# Altium schematic sheet Zynq Programmable Logic System (PL).SchDoc: Zynq Programmable Logic
size A3; DocumentNumber: 6; Revision: A; SheetNumber: 6; SheetTotal: 10
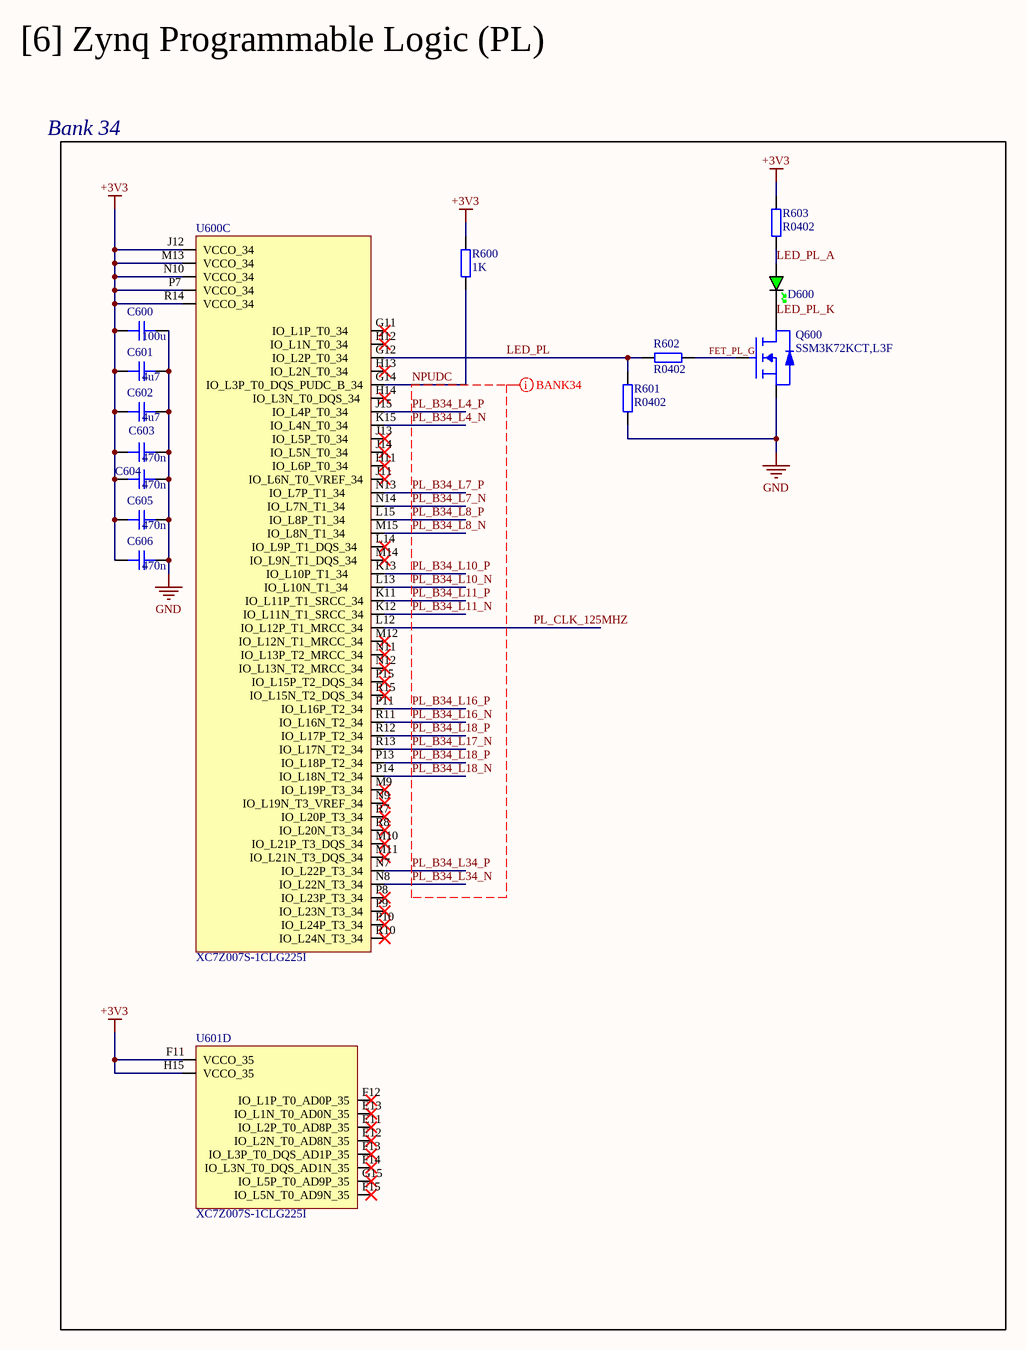
[diagram p0: Zynq Programmable Logic System (PL).SchDoc]

## Parts
C600  100u  [CAP_1210]
C601  4u7  [CAP_1210]
C602  4u7  [CAP_1210]
C603  470n  [CAP_1210]
C604  470n  [CAP_1210]
C605  470n  [CAP_1210]
C606  470n  [CAP_1210]
D600  GREEN  [LED_0402_GREEN]  (value not drawn)
Q600  SSM3K72KCT,L3F  [CST3-SOT-883]
R600  1K  [RES_0402]
R601  R0402  [RES_0402]
R602  R0402  [RES_0402]
R603  R0402  [RES_0402]
U600  XC7Z007S-1CLG225I  [CLG225]  (part C of 7)
U601  XC7Z007S-1CLG225I  [CLG225]  (part D of 7)

## Nets
+3V3: C600.1 C601.1 C602.1 C603.1 C604.1 C605.1 C606.1 R600.2 R603.2 U600.J12(VCCO_34) U600.M13(VCCO_34) U600.N10(VCCO_34) U600.P7(VCCO_34) U600.R14(VCCO_34) U601.F11(VCCO_35) U601.H15(VCCO_35)
GND: C600.2 C601.2 C602.2 C603.2 C604.2 C605.2 C606.2 Q600.S R601.1
FET_PL_G: Q600.G R602.2
LED_PL: R601.2 R602.1 U600.G12(IO_L2P_T0_34)
LED_PL_A: D600.A R603.1
LED_PL_K: D600.K Q600.D
NPUDC: R600.1 U600.G14(IO_L3P_T0_DQS_PUDC_B_34)
PL_B34_L4_N: U600.K15(IO_L4N_T0_34)
PL_B34_L4_P: U600.J15(IO_L4P_T0_34)
PL_B34_L7_N: U600.N14(IO_L7N_T1_34)
PL_B34_L7_P: U600.N13(IO_L7P_T1_34)
PL_B34_L8_N: U600.M15(IO_L8N_T1_34)
PL_B34_L8_P: U600.L15(IO_L8P_T1_34)
PL_B34_L10_N: U600.L13(IO_L10N_T1_34)
PL_B34_L10_P: U600.K13(IO_L10P_T1_34)
PL_B34_L11_N: U600.K12(IO_L11N_T1_SRCC_34)
PL_B34_L11_P: U600.K11(IO_L11P_T1_SRCC_34)
PL_B34_L16_N: U600.R11(IO_L16N_T2_34)
PL_B34_L16_P: U600.P11(IO_L16P_T2_34)
PL_B34_L17_N: U600.R13(IO_L17N_T2_34)
PL_B34_L18_N: U600.P14(IO_L18N_T2_34)
PL_B34_L18_P: U600.P13(IO_L18P_T2_34) U600.R12(IO_L17P_T2_34)
PL_B34_L34_N: U600.N8(IO_L22N_T3_34)
PL_B34_L34_P: U600.N7(IO_L22P_T3_34)
PL_CLK_125MHZ: U600.L12(IO_L12P_T1_MRCC_34)

Not connected (* = marked no-connect by the designer): U600 G11  (IO_L1P_T0_34_____)* H11  (IO_L6P_T0_34_____)* H12  (IO_L1N_T0_34_____)* H13  (IO_L2N_T0_34_____)* H14  (IO_L3N_T0_DQS_34_)* J11  (IO_L6N_T0_VREF_34)* J13  (IO_L5P_T0_34_____)* J14  (IO_L5N_T0_34_____)* L14  (IO_L9P_T1_DQS_34__)* M9   (IO_L19P_T3_34)* M10  (IO_L21P_T3_DQS_34)* M11  (IO_L21N_T3_DQS_34)* M12  (IO_L12N_T1_MRCC_34)* M14  (IO_L9N_T1_DQS_34__)* N9   (IO_L19N_T3_VREF_34)* N11  (IO_L13P_T2_MRCC_34)* N12  (IO_L13N_T2_MRCC_34)* P8   (IO_L23P_T3_34)* P9   (IO_L23N_T3_34)* P10  (IO_L24P_T3_34)* P15  (IO_L15P_T2_DQS_34)* R7   (IO_L20P_T3_34)* R8   (IO_L20N_T3_34)* R10  (IO_L24N_T3_34)* R15  (IO_L15N_T2_DQS_34)*; U601 E11  (IO_L2P_T0_AD8P_35)* E12  (IO_L2N_T0_AD8N_35)* E13  (IO_L1N_T0_AD0N_35)* F12  (IO_L1P_T0_AD0P_35)* F13  (IO_L3P_T0_DQS_AD1P_35)* F14  (IO_L3N_T0_DQS_AD1N_35)* F15  (IO_L5N_T0_AD9N_35)* G15  (IO_L5P_T0_AD9P_35)*

## Layout directives
mark named BANK34: NPUDC, PL_B34_L4_N, PL_B34_L4_P, PL_B34_L7_N, PL_B34_L7_P, PL_B34_L8_N, PL_B34_L8_P, PL_B34_L10_N, PL_B34_L10_P, PL_B34_L11_N, PL_B34_L11_P, PL_B34_L16_N, PL_B34_L16_P, PL_B34_L17_N, PL_B34_L18_N, PL_B34_L18_P, PL_B34_L34_N, PL_B34_L34_P

## Notes on the sheet
- [6] Zynq Programmable Logic (PL)
- Bank 34
- Title
- Size:
- Date:
- A3
- Number:
- Time:
- Revision:
- Sheet
- of
- File:

## Library data of the parts
C600-C606 = CAP_1210: Capacitor SMD 1210; Manufacturer: *; Manufacturer Part Number: *; Distributor Link: *; LCSC: *; Rating: *; Dielectric: *
D600 = LED_0402_GREEN: LED 0402 GREEN SMD
Q600 = SSM3K72KCT,L3F: MOSFET N-Channel Vds=60V Id=400mA Rds(on)=1.05R with ESD Protection; Manufacturer: Toshiba; Manufacturer Part Number: SSM3K72KCT,L3F; Distributor Link: https://www.mouser.de/ProductDetail/Toshiba/SSM3K72KCTL3F?qs=PDgMCp4xDJZBSQ%2Fqg29QOw%3D%3D
R600-R603 = RES_0402: Resistor SMD 0402; Manufacturer: *; Manufacturer Part Number: *; Distributor Link: *; LCSC: *
U600 U601 = XC7Z007S-1CLG225I: Xilinx FPGA SoC Zynq 7-Series XC7Z007S CLG255 Package Industrial Temperature Grade; Manufacturer: Xilinx; Manufacturer Part Number: XC7Z007S-1CLG225I